# Altium schematic sheet MCU.SchDoc
size A
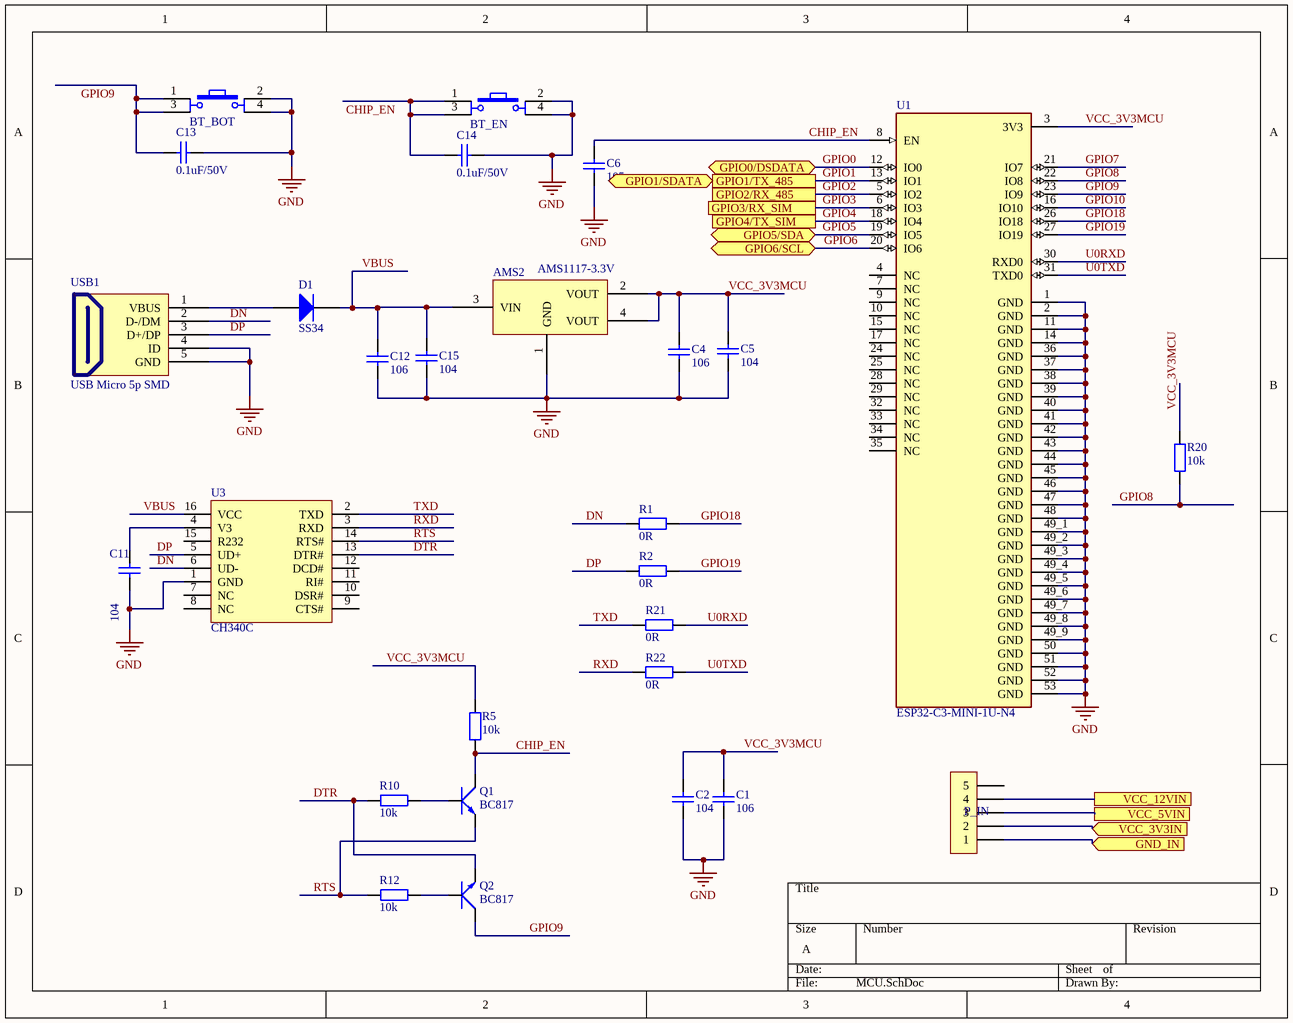
[diagram p0: MCU.SchDoc]

## Parts
AMS2  AMS1117-3.3V  [SOT223]
BT_BOT  Nut Nhan 4 Chan SMD 6x6  [Nut Nhan 4 Chan SMD 6x6]  (value not drawn)
BT_EN  Nut Nhan 4 Chan SMD 6x6  [Nut Nhan 4 Chan SMD 6x6]  (value not drawn)
C1  106  [tu 0603]
C2  104  [tu 0603]
C4  106  [tu 0805]
C5  104  [tu 0805]
C6  105  [tu 0603]
C11  104  [tu 0603]
C12  106  [tu 0805]
C13  0.1uF/50V  [tu 0603]
C14  0.1uF/50V  [tu 0603]
C15  104  [tu 0805]
D1  SS34  [DIODE SMA]
P_IN  Header 4P 2.54 Duc Thang  [XH2.54M-4]  (value not drawn)
Q1  BC817  [SOT-23]
Q2  BC817  [SOT-23]
R1  0R  [tro smd 0603]
R2  0R  [tro smd 0603]
R5  10k  [tro smd 0603]
R10  10k  [tro smd 0805]
R12  10k  [tro smd 0805]
R20  10k  [tro smd 0603]
R21  0R  [tro smd 0603]
R22  0R  [tro smd 0603]
U1  ESP32-C3-MINI-1U-N4  [XCVR_ESP32-C3-MINI-1U-N4]
U3  CH340C  [SOIC16_50_284_25X90_SMT]
USB1  USB Micro 5p SMD  [USB Micro 5p SMD]

## Ports
GND_IN (in), GPIO0/DSDATA (bidir), GPIO1/SDATA (bidir), GPIO1/TX_485, GPIO2/RX_485, GPIO3/RX_SIM, GPIO4/TX_SIM, GPIO5/SDA (bidir), GPIO6/SCL (bidir), VCC_3V3IN (in), VCC_5VIN, VCC_12VIN

## Nets
GND: AMS2.1(GND) BT_BOT.2 BT_BOT.4 BT_EN.2 BT_EN.4 C1.2 C2.2 C4.2 C5.2 C6.2 C11.2 C12.2 C13.1 C14.1 C15.2 U1.1(GND) U1.2(GND) U1.11(GND) U1.14(GND) U1.36(GND) U1.37(GND) U1.38(GND) U1.39(GND) U1.40(GND) U1.41(GND) U1.42(GND) U1.43(GND) U1.44(GND) U1.45(GND) U1.46(GND) U1.47(GND) U1.48(GND) U1.49_1(GND) U1.49_2(GND) U1.49_3(GND) U1.49_4(GND) U1.49_5(GND) U1.49_6(GND) U1.49_7(GND) U1.49_8(GND) U1.49_9(GND) U1.50(GND) U1.51(GND) U1.52(GND) U1.53(GND) U3.1(GND) USB1.4(ID) USB1.5(GND)
CHIP_EN: BT_EN.1 BT_EN.3 C6.1 C14.2 Q1.3(C) R5.1 U1.8(EN)
DN: R1.1 U3.6(UD-) USB1.2(D-/DM)
DP: R2.1 U3.5(UD+) USB1.3(D+/DP)
DTR: Q2.2(E) R10.1 U3.13(DTR#)
GND_IN: P_IN.1 ; port GND_IN
GPIO0: U1.12(IO0) ; port GPIO0/DSDATA
GPIO1: U1.13(IO1) ; port GPIO1/TX_485, port GPIO1/SDATA
GPIO2: U1.5(IO2) ; port GPIO2/RX_485
GPIO3: U1.6(IO3) ; port GPIO3/RX_SIM
GPIO4: U1.18(IO4) ; port GPIO4/TX_SIM
GPIO5: U1.19(IO5) ; port GPIO5/SDA
GPIO6: U1.20(IO6) ; port GPIO6/SCL
GPIO7: U1.21(IO7)
GPIO8: R20.1 U1.22(IO8)
GPIO9: BT_BOT.1 BT_BOT.3 C13.2 Q2.3(C) U1.23(IO9)
GPIO10: U1.16(IO10)
GPIO18: R1.2 U1.26(IO18)
GPIO19: R2.2 U1.27(IO19)
RTS: Q1.2(E) R12.1 U3.14(RTS#)
RXD: R22.1 U3.3(RXD)
TXD: R21.1 U3.2(TXD)
U0RXD: R21.2 U1.30(RXD0)
U0TXD: R22.2 U1.31(TXD0)
VBUS: AMS2.3(VIN) C12.1 C15.1 D1.2(K) U3.16(VCC)
VCC_3V3IN: P_IN.2 ; port VCC_3V3IN
VCC_3V3MCU: AMS2.2(VOUT) AMS2.4(VOUT) C1.1 C2.1 C4.1 C5.1 R5.2 R20.2 U1.3(3V3)
VCC_5VIN: P_IN.3 ; port VCC_5VIN
VCC_12VIN: P_IN.4 ; port VCC_12VIN
NetC11_1: C11.1 U3.4(V3)
NetD1_1: D1.1(A) USB1.1(VBUS)
NetQ1_1: Q1.1(B) R10.2
NetQ2_1: Q2.1(B) R12.2

Not connected (* = marked no-connect by the designer): P_IN 5; U1 4(NC) 7(NC) 9(NC) 10(NC) 15(NC) 17(NC) 24(NC) 25(NC) 28(NC) 29(NC) 32(NC) 33(NC) 34(NC) 35(NC); U3 7(NC) 8(NC) 9(CTS#) 10(DSR#) 11(RI#) 12(DCD#) 15(R232)

## Library data of the parts
AMS2 = AMS1117 SMD: Dán; Value: AMS1117-3.3V SOT223; Don_Vi: Con; Ma_Hang: MH000596; Ghi_Chu: *; Kieu_Chan: *; Chung_Loai: Dán
BT_BOT BT_EN = Nut Nhan 4 Chan SMD 6x6: Nut Nhan 4 Chan 6.2x6.2x3.5; Ten: Nút Nhấn 4 Chân 6.2x6.2x3.1MM SMD; Ma_Hang: MH002424
C1 = Tu 0603 106 16V 20%: Dán; Don_Vi: Con; So_Chan: 2; Ten_Linh_Kien: Tụ 0603-10uF 20% 16V; Ma_Hang: MH004848; Chung_Loai: Dán; Kieu_Chan: *
C2 C11 = Tu 0603 104 50V 10%: Dán; Don_Vi: Con; So_Chan: 2; Ten_Linh_Kien: Tụ 0603 104-100nF 10% 50V; Ma_Hang: MH004568; Chung_Loai: Dán; Kieu_Chan: *
C4 C12 = Tu 0805 106 16V 10%: Dán; Ten_Linh_Kien: Tụ 0805 106-10uF 10% 16V; So_Chan: 2; Don_Vi: Con; Ma_Hang: MH004553; Chung_Loai: Dán; Kieu_Chan: *
C5 C15 = Tu 0805 104 50V 10%: Dán; Don_Vi: Con; So_Chan: 2; Ten_Linh_Kien: Tụ 0805 104-100nF 10% 50V; Ma_Hang: MH004551; Chung_Loai: Dán; Kieu_Chan: *
C6 C13 C14 = Tu 0603 105 50V 10%: Dán; Don_Vi: Con; So_Chan: 2; Ten_Linh_Kien: Tụ 0603 105-1uF 50V 10%; Ma_Hang: MH004569; Chung_Loai: Dán; Kieu_Chan: *
D1 = Diode SS34 ( 1N5822 ): Dán; Don_Vi: Con; Ma_Hang: MH002104; Ten_Linh_Kien: Diode SS34 3A 40V SMA ( 1N5822 SS34A); Kieu_Chan: *; Chung_Loai: Dán
P_IN = Header 5P 2.54 Duc Thang: Cắm; Ten_Linh_Kien: Header 5P XH2.54-5P Đực Thẳng; Don_Vi: Con; Ma_Hang: MH001298; Chung_Loai: Cắm
Q1 Q2 = Trans BC817: SOT-23 - C8658; Value: C9014
R1 R2 R21 R22 = Tro 0603 1% 0R: Dán; Don_Vi: Con; So_Chan: 2; Ten_Linh_Kien: Trở 0603 1% 0R; Ma_Hang: MH005792; Chung_Loai: Dán; Kieu_Chan: *
R5 R20 = Tro 0603 1% 10k: Dán; Don_Vi: Con; So_Chan: 2; Ten_Linh_Kien: Trở 0603 1% 10k; Ma_Hang: MH006333; Chung_Loai: Dán; Kieu_Chan: *
R10 R12 = Tro 0805 1% 10k: Dán; Don_Vi: Con; So_Chan: 2; Ten_Linh_Kien: Trở 0805 1% 10k; Ma_Hang: MH005473; Chung_Loai: Dán; Kieu_Chan: *
U1 = ESP32-C3-MINI-1U-N4: Bluetooth, WiFi 802.11b/g/n, Bluetooth v5.0 Transceiver Module 2.412GHz ~ 2.484GHz Antenna Not Included, I-PEX Surface Mount; MF: Espressif Systems; Value: *; SnapEDA_Link: https://www.snapeda.com/parts/ESP32-C3-MINI-1U-N4/Espressif+Systems/view-part/?ref=snap; MP: ESP32-C3-MINI-1U-N4; Purchase-URL: https://pricing.snapeda.com/search/part/ESP32-C3-MINI-1U-N4/?ref=eda; Check_prices: https://www.snapeda.com/parts/ESP32-C3-MINI-1U-N4/Espressif+Systems/view-part/?ref=eda; Availability: In Stock; Price: None; Package: None
U3 = IC_CH340C: USB Bridge, USB to UART USB 2.0 UART Interface; Manufacturer: Olimex; Alternate Part Number-1: NA; Manufacturer Part Number: CH340C; Case/Package: SOIC16; Supplier-1: LCSC; Supplier Part Number-1: C84681
USB1 = USB Micro 5p SMD: USB Type B; Ten: MicroUSB MK5P SMD; Ma_Hang: MH001020